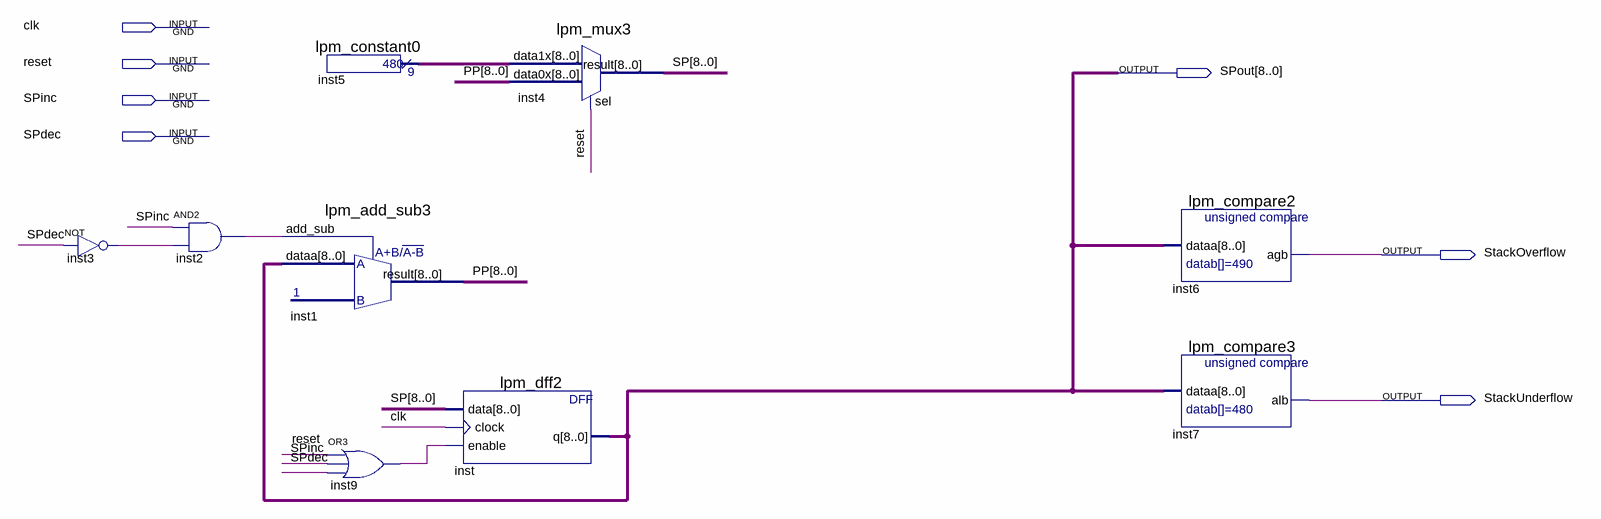
[diagram p0: schematic sheet]
// Quartus schematic SP.bdf as structural Verilog: 9 symbols, 7 pins
module SP (
  input  clk,
  input  reset,
  input  SPinc,
  input  SPdec,
  output [8:0] SPout,
  output StackOverflow,
  output StackUnderflow
);

  wire inst2_out, inst3_out, inst9_out;
  wire [8:0] inst5_result, PP, SP;

  not inst3 (inst3_out, SPdec);
  and inst2 (inst2_out, SPinc, inst3_out);
  lpm_add_sub3 inst1 (.dataa(SPout), .add_sub(inst2_out), .result(PP));
  lpm_constant0 inst5 (.result(inst5_result));
  or inst9 (inst9_out, reset, SPinc, SPdec);
  lpm_mux3 inst4 (.data1x(inst5_result), .data0x(PP), .sel(reset), .result(SP));
  lpm_dff2 inst (.data(SP), .clock(clk), .enable(inst9_out), .q(SPout));
  lpm_compare2 inst6 (.dataa(SPout), .agb(StackOverflow));
  lpm_compare3 inst7 (.dataa(SPout), .alb(StackUnderflow));
endmodule
